# Altium schematic sheet FlightController.SchDoc
size A3; Date: 26.03.2022; Engineer: Burak; SheetNumber: 1; SheetTotal: 1; SheetSize: A3
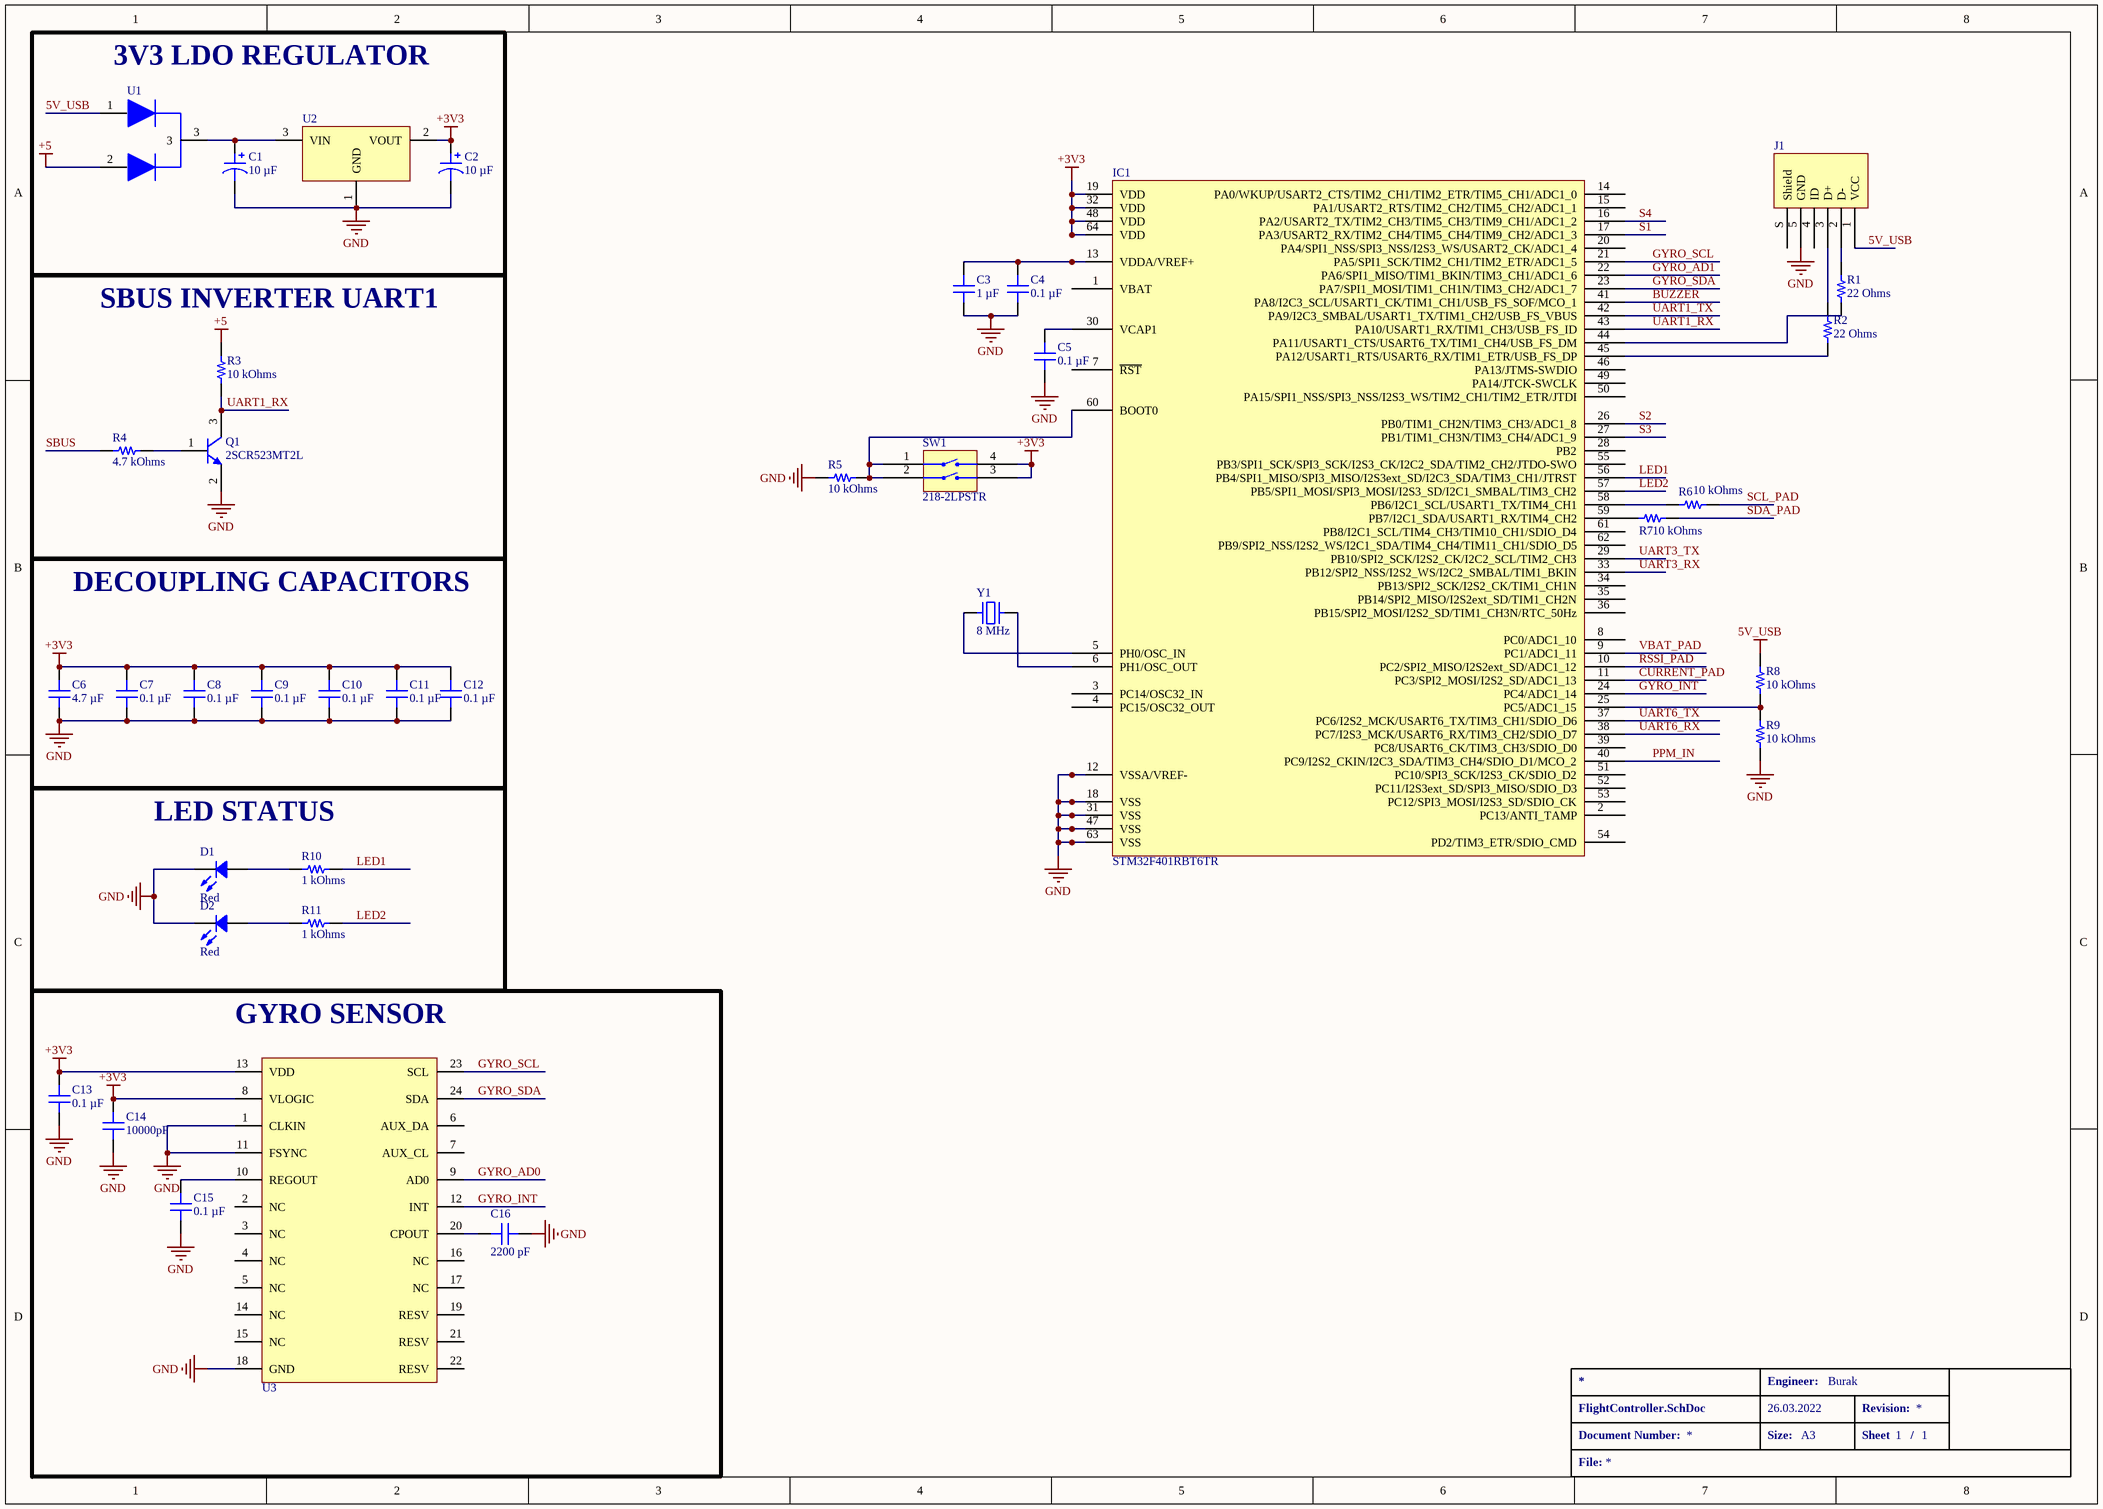
[diagram p0: FlightController.SchDoc]

## Parts
C1  10 µF  [CAP ALSMD POLY 5.3MM H5.8MM]
C2  10 µF  [CAP ALSMD POLY 5.3MM H5.8MM]
C3  1 µF  [CAP 0805_2012]
C4  0.1 µF  [CAP 0805_2012]
C5  0.1 µF  [CAP 0805_2012]
C6  4.7 µF  [CAP 0805_2012]
C7  0.1 µF  [CAP 0805_2012]
C8  0.1 µF  [CAP 0805_2012]
C9  0.1 µF  [CAP 0805_2012]
C10  0.1 µF  [CAP 0805_2012]
C11  0.1 µF  [CAP 0805_2012]
C12  0.1 µF  [CAP 0805_2012]
C13  0.1 µF  [CAP 0805_2012]
C14  10000pF  [CAP 0805_2012]
C15  0.1 µF  [CAP 0805_2012]
C16  2200 pF  [CAP 0805_2012]
D1  Red  [LED 1206_3216 RED]
D2  Red  [LED 1206_3216 RED]
IC1  STM32F401RBT6TR  [ST LQFP-64 10X10MM]
J1  10118193-0001LF  [FCI USB 10118193-0001LF]  (value not drawn)
Q1  2SCR523MT2L  [ROHM SOT-723]
R1  22 Ohms  [RES 0805_2012]
R2  22 Ohms  [RES 0805_2012]
R3  10 kOhms  [RES 0805_2012]
R4  4.7 kOhms  [RES 0805_2012]
R5  10 kOhms  [RES 0805_2012]
R6  10 kOhms  [RES 0805_2012]
R7  10 kOhms  [RES 0805_2012]
R8  10 kOhms  [RES 0805_2012]
R9  10 kOhms  [RES 0805_2012]
R10  1 kOhms  [RES 0805_2012]
R11  1 kOhms  [RES 0805_2012]
SW1  218-2LPSTR  [CTS 218-2LPJ]
U1  BAT54C  [SOT-23]  (value not drawn)
U2  IC REG LDO 3.3V 1A SOT223  [SOT223]  (value not drawn)
U3  GYRO SENSOR  [QFN_24PINS]  (value not drawn)
Y1  8 MHz  [ABRACON ABLS]

## Blocks framed on the sheet
3V3 LDO REGULATOR: C1 C2 U1 U2
SBUS INVERTER UART1: Q1 R3 R4
DECOUPLING CAPACITORS: C6-C12
LED STATUS: D1 D2 R10 R11
GYRO SENSOR: C13-C16 U3

## Nets
5V_USB: J1.1(VCC) R8.2 U1.1
+3V3: C2.1 C6.2 C7.2 C8.2 C9.2 C10.2 C11.2 C12.2 C13.2 C14.2 IC1.19(VDD) IC1.32(VDD) IC1.48(VDD) IC1.64(VDD) SW1.3(GND) SW1.4(GND) U2.2(VOUT) U3.8(VLOGIC) U3.13(VDD)
+5: R3.2 U1.2
GND: C1.2 C2.2 C3.1 C4.1 C5.1 C6.1 C7.1 C8.1 C9.1 C10.1 C11.1 C12.1 C13.1 C14.1 C15.1 C16.2 D1.2 D2.2 IC1.12(VSSA/VREF-) IC1.18(VSS) IC1.31(VSS) IC1.47(VSS) IC1.63(VSS) J1.5(GND) Q1.2(E) R5.2 R9.1 U2.1(GND) U3.1(CLKIN) U3.11(FSYNC) U3.18(GND)
BUZZER: IC1.41(PA8/I2C3_SCL/USART1_CK/TIM1_CH1/USB_FS_SOF/MCO_1)
CURRENT_PAD: IC1.11(PC3/SPI2_MOSI/I2S2_SD/ADC1_13)
GYRO_AD0: U3.9(AD0)
GYRO_AD1: IC1.22(PA6/SPI1_MISO/TIM1_BKIN/TIM3_CH1/ADC1_6)
GYRO_INT: IC1.24(PC4/ADC1_14) U3.12(INT)
GYRO_SCL: IC1.21(PA5/SPI1_SCK/TIM2_CH1/TIM2_ETR/ADC1_5) U3.23(SCL)
GYRO_SDA: IC1.23(PA7/SPI1_MOSI/TIM1_CH1N/TIM3_CH2/ADC1_7) U3.24(SDA)
LED1: IC1.56(PB4/SPI1_MISO/SPI3_MISO/I2S3ext_SD/I2C3_SDA/TIM3_CH1/JTRST) R10.2
LED2: IC1.57(PB5/SPI1_MOSI/SPI3_MOSI/I2S3_SD/I2C1_SMBAL/TIM3_CH2) R11.2
PPM_IN: IC1.40(PC9/I2S2_CKIN/I2C3_SDA/TIM3_CH4/SDIO_D1/MCO_2)
RSSI_PAD: IC1.10(PC2/SPI2_MISO/I2S2ext_SD/ADC1_12)
S1: IC1.17(PA3/USART2_RX/TIM2_CH4/TIM5_CH4/TIM9_CH2/ADC1_3)
S2: IC1.26(PB0/TIM1_CH2N/TIM3_CH3/ADC1_8)
S3: IC1.27(PB1/TIM1_CH3N/TIM3_CH4/ADC1_9)
S4: IC1.16(PA2/USART2_TX/TIM2_CH3/TIM5_CH3/TIM9_CH1/ADC1_2)
SBUS: R4.1
SCL_PAD: R6.1
SDA_PAD: R7.1
UART1_RX: IC1.43(PA10/USART1_RX/TIM1_CH3/USB_FS_ID) Q1.3(C) R3.1
UART1_TX: IC1.42(PA9/I2C3_SMBAL/USART1_TX/TIM1_CH2/USB_FS_VBUS)
UART3_RX: IC1.33(PB12/SPI2_NSS/I2S2_WS/I2C2_SMBAL/TIM1_BKIN)
UART3_TX: IC1.29(PB10/SPI2_SCK/I2S2_CK/I2C2_SCL/TIM2_CH3)
UART6_RX: IC1.38(PC7/I2S3_MCK/USART6_RX/TIM3_CH2/SDIO_D7)
UART6_TX: IC1.37(PC6/I2S2_MCK/USART6_TX/TIM3_CH1/SDIO_D6)
VBAT_PAD: IC1.9(PC1/ADC1_11)
NetC1_1: C1.1 U1.3 U2.3(VIN)
NetC3_2: C3.2 C4.2 IC1.13(VDDA/VREF+)
NetC5_2: C5.2 IC1.30(VCAP1)
NetC15_2: C15.2 U3.10(REGOUT)
NetC16_1: C16.1 U3.20(CPOUT)
NetD1_1: D1.1 R10.1
NetD2_1: D2.1 R11.1
NetIC1_5: IC1.5(PH0/OSC_IN) Y1.1
NetIC1_6: IC1.6(PH1/OSC_OUT) Y1.2
NetIC1_25: IC1.25(PC5/ADC1_15) R8.1 R9.2
NetIC1_44: IC1.44(PA11/USART1_CTS/USART6_TX/TIM1_CH4/USB_FS_DM) R1.1
NetIC1_45: IC1.45(PA12/USART1_RTS/USART6_RX/TIM1_ETR/USB_FS_DP) R2.1
NetIC1_58: IC1.58(PB6/I2C1_SCL/USART1_TX/TIM4_CH1) R6.2
NetIC1_59: IC1.59(PB7/I2C1_SDA/USART1_RX/TIM4_CH2) R7.2
NetIC1_60: IC1.60(BOOT0) R5.1 SW1.1(GND) SW1.2(GND)
NetJ1_2: J1.2(D-) R1.2
NetJ1_3: J1.3(D+) R2.2
NetQ1_1: Q1.1(B) R4.2

Not connected (* = marked no-connect by the designer): IC1 1(VBAT) 2(PC13/ANTI_TAMP) 3(PC14/OSC32_IN) 4(PC15/OSC32_OUT) 7(~{RST}) 8(PC0/ADC1_10) 14(PA0/WKUP/USART2_CTS/TIM2_CH1/TIM2_ETR/TIM5_CH1/ADC1_0) 15(PA1/USART2_RTS/TIM2_CH2/TIM5_CH2/ADC1_1) 20(PA4/SPI1_NSS/SPI3_NSS/I2S3_WS/USART2_CK/ADC1_4) 28(PB2) 34(PB13/SPI2_SCK/I2S2_CK/TIM1_CH1N) 35(PB14/SPI2_MISO/I2S2ext_SD/TIM1_CH2N) 36(PB15/SPI2_MOSI/I2S2_SD/TIM1_CH3N/RTC_50Hz) 39(PC8/USART6_CK/TIM3_CH3/SDIO_D0) 46(PA13/JTMS-SWDIO) 49(PA14/JTCK-SWCLK) 50(PA15/SPI1_NSS/SPI3_NSS/I2S3_WS/TIM2_CH1/TIM2_ETR/JTDI) 51(PC10/SPI3_SCK/I2S3_CK/SDIO_D2) 52(PC11/I2S3ext_SD/SPI3_MISO/SDIO_D3) 53(PC12/SPI3_MOSI/I2S3_SD/SDIO_CK) 54(PD2/TIM3_ETR/SDIO_CMD) 55(PB3/SPI1_SCK/SPI3_SCK/I2S3_CK/I2C2_SDA/TIM2_CH2/JTDO-SWO) 61(PB8/I2C1_SCL/TIM4_CH3/TIM10_CH1/SDIO_D4) 62(PB9/SPI2_NSS/I2S2_WS/I2C1_SDA/TIM4_CH4/TIM11_CH1/SDIO_D5); J1 4(ID) S(Shield); U3 2(NC) 3(NC) 4(NC) 5(NC) 6(AUX_DA) 7(AUX_CL) 14(NC) 15(NC) 16(NC) 17(NC) 19(RESV) 21(RESV) 22(RESV)

## Notes on the sheet
- Engineer:
- Document Number:
- Size:
- Sheet
- Revision:
- /
- File:

## Library data of the parts
C1 C2 = 875105359001: CAP ALUM POLY 10UF 20% 16V SMD; manufacturer: Würth Elektronik; ESR (Equivalent Series Resistance): 30mOhm; Lifetime @ Temp.: 2000 Hrs @ 105°C; Ripple Current @ High Frequency: 2.2 A @ 100 kHz; Ripple Current @ Low Frequency: 110 mA @ 120 Hz; Surface Mount Land Size: 0.209" L x 0.209" W (5.30mm x 5.30mm); Type: Polymer; Part Number: 875105359001; Applications: General Purpose; Capacitance: 10 µF; componentlink1description: Datasheet; componentlink1url: https://katalog.we-online.de/pbs/datasheet/875105359001.pdf; componentlink2description: DigiKey Link; componentlink2url: https://www.digikey.com/en/products/detail/würth-elektronik/875105359001/5147580; Device Package: Radial, Can - SMD; Height - Seated (Max): 0.228" (5.80mm); lastupdated: 25.06.2022 14:19:37; Lifecycle Status: Active; Minimum Order: 1; Mounting Type: Surface Mount; Operating Temperature: -55°C ~ 105°C; Package / Case: Radial, Can - SMD; packaging: TapeAndReel; partid: 1907; Part Status: Active; price: 0.28; series: WCAP-PSLP; Size / Dimension: 0.197" Dia (5.00mm); Supplier 1: DigiKey; Supplier Part Number 1: 732-6416-1-ND; Tolerance: ±20%; value: 10 µF; Voltage - Rated: 16 V
C3 = C2012X8R1C105K125AB: CAP CER 1UF 16V X8R 0805; manufacturer: TDK Corporation; Tolerance: ±10%; Part Number: C2012X8R1C105K125AB; Value: 1 µF; Applications: General Purpose; Capacitance: 1 µF; componentlink1description: Datasheet; componentlink1url: https://product.tdk.com/info/en/catalog/datasheets/mlcc_commercial_hightemp_en.pdf?ref_disty=digikey; componentlink2description: DigiKey Link; componentlink2url: https://www.digikey.com/en/products/detail/tdk-corporation/C2012X8R1C105K125AB/3248171; Device Package: 0805 (2012 Metric); Features: High Temperature; lastupdated: 25.03.2022 19:02:17; Lifecycle Status: Active; Minimum Order: 1; Mounting Type: Surface Mount, MLCC; Operating Temperature: -55°C ~ 150°C; Package / Case: 0805 (2012 Metric); packaging: TapeAndReel; partid: 2997; Part Status: Active; price: 0.08; series: C; Size / Dimension: 0.079" L x 0.049" W (2.00mm x 1.25mm); Supplier 1: DigiKey; Supplier Part Number 1: 445-8829-1-ND; Temperature Coefficient: X8R; Thickness (Max): 0.057" (1.45mm); Voltage - Rated: 16V
C4 C5 C7-C12 = 160R15W104KV4T: CAP CER 0.1UF 16V X7R 0805; manufacturer: Johanson Dielectrics Inc.; Tolerance: ±10%; Part Number: 160R15W104KV4T; Value: 0.1 µF; Applications: General Purpose; Capacitance: 0.1 µF; componentlink1description: Datasheet; componentlink1url: https://www.johansondielectrics.com/downloads/catalog/johanson-dielectrics-product-catalog.pdf; componentlink2description: DigiKey Link; componentlink2url: https://www.digikey.com/en/products/detail/johanson-dielectrics-inc/160R15W104KV4T/1859428; Device Package: 0805 (2012 Metric); lastupdated: 25.03.2022 19:02:00; Lifecycle Status: Active; Minimum Order: 1; Mounting Type: Surface Mount, MLCC; Operating Temperature: -55°C ~ 125°C; Package / Case: 0805 (2012 Metric); packaging: TapeAndReel; partid: 9125; Part Status: Active; price: 0.03; series: -; Size / Dimension: 0.080" L x 0.050" W (2.03mm x 1.27mm); Supplier 1: DigiKey; Supplier Part Number 1: 709-1183-1-ND; Temperature Coefficient: X7R; Thickness (Max): 0.050" (1.27mm); Voltage - Rated: 16V
C6 = CL21A475KPFNNNE: CAP CER 4.7UF 10V X5R 0805; manufacturer: Samsung Electro-Mechanics; Tolerance: ±10%; Part Number: CL21A475KPFNNNE; Value: 4.7 µF; Applications: General Purpose; Capacitance: 4.7 µF; componentlink1description: Datasheet; componentlink1url: http://www.samsungsem.com/kr/support/product-search/mlcc/CL21A475KPFNNNE.jsp; componentlink2description: DigiKey Link; componentlink2url: https://www.digikey.com/en/products/detail/samsung-electro-mechanics/CL21A475KPFNNNE/3886917; Device Package: 0805 (2012 Metric); lastupdated: 25.03.2022 19:02:16; Lifecycle Status: Active; Minimum Order: 1; Mounting Type: Surface Mount, MLCC; Operating Temperature: -55°C ~ 85°C; Package / Case: 0805 (2012 Metric); packaging: TapeAndReel; partid: 3193; Part Status: Active; price: 0.01; series: CL; Size / Dimension: 0.079" L x 0.049" W (2.00mm x 1.25mm); Supplier 1: DigiKey; Supplier Part Number 1: 1276-1259-1-ND; Temperature Coefficient: X5R; Thickness (Max): 0.053" (1.35mm); Voltage - Rated: 10V
C13 C15 = 0805B104K160CT: CAP CER 0.1UF 16V X7R 0805; manufacturer: Walsin Technology Corporation; Tolerance: ±10%; Part Number: 0805B104K160CT; Value: 0.1 µF; Applications: General Purpose; Capacitance: 0.1 µF; componentlink1description: Datasheet; componentlink1url: http://www.passivecomponent.com/wp-content/uploads/2018/10/MLCC.pdf; componentlink2description: DigiKey Link; componentlink2url: https://www.digikey.com/en/products/detail/walsin-technology-corporation/0805B104K160CT/9355062; Device Package: 0805 (2012 Metric); lastupdated: 2.04.2022 05:58:35; Lifecycle Status: Active; Minimum Order: 1; Mounting Type: Surface Mount, MLCC; Operating Temperature: -55°C ~ 125°C; Package / Case: 0805 (2012 Metric); packaging: TapeAndReel; partid: 4882; Part Status: Active; price: 0.01; series: -; Size / Dimension: 0.079" L x 0.049" W (2.00mm x 1.25mm); Supplier 1: DigiKey; Supplier Part Number 1: 1292-1565-1-ND; Temperature Coefficient: X7R; Thickness (Max): 0.035" (0.90mm); Voltage - Rated: 16V
C14 = 0805YC103KAT2A: CAP CER 10000PF 16V X7R 0805; manufacturer: AVX Corporation; Tolerance: ±10%; Part Number: 0805YC103KAT2A; Value: 10000pF; Applications: General Purpose; Capacitance: 10000pF; componentlink1description: Datasheet; componentlink1url: http://datasheets.avx.com/X7RDielectric.pdf; componentlink2description: DigiKey Link; componentlink2url: http://digikey.com/product-detail/en/avx-corporation/0805YC103KAT2A/478-12793-1-ND/9949333; Device Package: 0805 (2012 Metric); lastupdated: 2.09.2020 01:04:37; Lifecycle Status: Active; Minimum Order: 1; Mounting Type: Surface Mount, MLCC; Operating Temperature: -55°C ~ 125°C; Package / Case: 0805 (2012 Metric); packaging: TapeAndReel; partid: 5374; Part Status: Active; price: 0.03; series: -; Size / Dimension: 0.079" L x 0.049" W (2.01mm x 1.25mm); Supplier 1: DigiKey; Supplier Part Number 1: 478-12793-1-ND; Temperature Coefficient: X7R; Thickness (Max): 0.037" (0.94mm); Voltage - Rated: 16V
C16 = 885012207009: CAP CER 2200PF 10V X7R 0805; manufacturer: Würth Elektronik; Tolerance: ±10%; Part Number: 885012207009; Value: 2200 pF; Applications: General Purpose; Capacitance: 2200 pF; componentlink1description: Datasheet; componentlink1url: https://katalog.we-online.de/pbs/datasheet/885012207009.pdf; componentlink2description: DigiKey Link; componentlink2url: https://www.digikey.com/en/products/detail/würth-elektronik/885012207009/5453874; Device Package: 0805 (2012 Metric); lastupdated: 2.04.2022 05:58:23; Lifecycle Status: Active; Minimum Order: 1; Mounting Type: Surface Mount, MLCC; Operating Temperature: -55°C ~ 125°C; Package / Case: 0805 (2012 Metric); packaging: TapeAndReel; partid: 9414; Part Status: Active; price: 0.03; series: WCAP-CSGP; Size / Dimension: 0.079" L x 0.049" W (2.00mm x 1.25mm); Supplier 1: DigiKey; Supplier Part Number 1: 732-8019-1-ND; Temperature Coefficient: X7R; Thickness (Max): 0.035" (0.90mm); Voltage - Rated: 10V
D1 D2 = 5973111402F: LED RED CLEAR 1206 SMD; Manufacturer: Dialight; Configuration: Standard; Current - Test: 20mA; Lens Color: Colorless; Lens Style: Round with Flat Top; Millicandela Rating: 33.6mcd; Viewing Angle: 70°; Voltage - Forward (Vf) (Typ): 1.7V; Wavelength - Dominant: 647nm; Wavelength - Peak: 660nm; Part Number: 5973111402F; Color: Red; ComponentLink1Description: Datasheet; ComponentLink1URL: http://www.dialightsignalsandcomponents.com/Assets/Brochures_And_Catalogs/Indication/SMT_selector_guide.pdf; ComponentLink2Description: DigiKey Link; ComponentLink2URL: https://www.digikey.com/en/products/detail/dialight/5973111402F/2432500; Device Package: 1206 (3216 Metric); Height (Max): 1.51mm; LastUpdated: 25.03.2022 19:41:37; Lens Transparency: Clear; Lifecycle Status: Active; Minimum Order: 1; Mounting Type: Surface Mount; Package / Case: 1206 (3216 Metric); Packaging: Strip; PartId: 1070; Part Status: Active; Price: 0.27; Series: 597; Size / Dimension: 3.00mm L x 1.50mm W; Supplier 1: DigiKey; Supplier Part Number 1: 350-2880-ND; Supplier Device Package: 1206; Value: Red
IC1 = STM32F401RBT6TR: IC MCU 32BIT 128KB FLASH 64LQFP; Manufacturer: STMicroelectronics; Connectivity: I²C, IrDA, LINbus, SDIO, SPI, UART/USART, USB OTG; Core Processor: ARM® Cortex®-M4; Core Size: 32-Bit; Data Converters: A/D 16x12b; Number of I/O: 50; Oscillator Type: Internal; Peripherals: Brown-out Detect/Reset, DMA, I²S, POR, PWM, WDT; Program Memory Size: 128KB (128K x 8); RAM Size: 64K x 8; Speed: 84MHz; Voltage - Supply (Vcc/Vdd): 1.7V ~ 3.6V; Part Number: STM32F401RBT6TR; ComponentLink1Description: Datasheet; ComponentLink1URL: http://www.st.com/content/ccc/resource/technical/document/datasheet/9e/50/b1/5a/5f/ae/4d/c1/DM00086815.pdf/files/DM00086815.pdf/jcr:content/translations/en.DM00086815.pdf; ComponentLink2Description: DigiKey Link; ComponentLink2URL: //digikey.com/product-detail/en/stmicroelectronics/STM32F401RBT6TR/497-18782-2-ND/5268280; Device Package: 64-LQFP; LastUpdated: 4.12.2019 05:53:46; Lifecycle Status: 0; Minimum Order: 1; Mounting Type: Surface Mount; Operating Temperature: -40°C ~ 85°C (TA); Package / Case: 64-LQFP; Packaging: TapeAndReel; PartId: 114; Part Status: Active; Price: 2.54; Program Memory Type: FLASH; Series: STM32F4; Supplier 1: DigiKey; Supplier Part Number 1: 497-18782-2-ND; Supplier Device Package: 64-LQFP (10x10)
J1 = 10118193-0001LF: CONN RCPT USB2.0 MICRO B SMD R/A; Manufacturer: Amphenol ICC (FCI); Connector Type: USB - micro B; Current Rating (Amps): 1.8A per Contact; Gender: Receptacle; Mating Cycles: 10000; Number of Contacts: 5; Number of Ports: 1; Shielding: Shielded; Voltage - Rated: 100VAC; Part Number: 10118193-0001LF; ComponentLink1Description: Datasheet; ComponentLink1URL: https://cdn.amphenol-icc.com/media/wysiwyg/files/documentation/datasheet/inputoutput/io_usb_micro.pdf; ComponentLink2Description: DigiKey Link; ComponentLink2URL: //digikey.com/product-detail/en/amphenol-icc-fci/10118193-0001LF/609-4616-2-ND/2785388; Features: Solder Retention; LastUpdated: 9.12.2019 20:51:28; Lifecycle Status: 0; Minimum Order: 1; Mounting Feature: Horizontal; Mounting Type: Surface Mount, Right Angle; Through Hole; Operating Temperature: -30°C ~ 80°C; Packaging: TapeAndReel; Part Status: Active; Price: 0.21; Series: -; Specifications: USB 2.0; Supplier 1: DigiKey; Supplier Part Number 1: 609-4616-2-ND; Termination: Solder
Q1 = 2SCR523MT2L: TRANS NPN 50V 0.1A VMT3; Manufacturer: Rohm Semiconductor; Current - Collector Cutoff (Max): 100nA (ICBO); Current - Collector (Ic) (Max): 100 mA; DC Current Gain (hFE) (Min) @ Ic, Vce: 120 @ 1mA, 6V; Frequency - Transition: 350MHz; Power - Max: 150 mW; Vce Saturation (Max) @ Ib, Ic: 300mV @ 5mA, 50mA; Part Number: 2SCR523MT2L; ComponentLink1Description: Datasheet; ComponentLink1URL: http://rohmfs.rohm.com/en/products/databook/datasheet/discrete/transistor/bipolar/2scr523mt2l-e.pdf; ComponentLink2Description: DigiKey Link; ComponentLink2URL: https://www.digikey.com/en/products/detail/rohm-semiconductor/2SCR523MT2L/5019055; LastUpdated: 29.06.2022 14:53:08; Lifecycle Status: Active; Minimum Order: 1; Mounting Type: Surface Mount; Operating Temperature: 150°C (TJ); Package / Case: SOT-723; Packaging: TapeAndReel; PartId: 1; Part Status: Active; Price: 0.03; Series: -; Supplier 1: DigiKey; Supplier Part Number 1: 2SCR523MT2LCT-ND; Supplier Device Package: VMT3; Transistor Type: NPN; Voltage - Collector Emitter Breakdown (Max): 50 V
R1 R2 = CPF0805B22RE1: RES SMD 22 OHM 0.1% 1/10W 0805; Manufacturer: TE Connectivity Passive Product; Power (Watts): 0.1W, 1/10W; Temperature Coefficient: ±25ppm/°C; Part Number: CPF0805B22RE1; Value: 22 Ohms; ComponentLink1Description: Datasheet; ComponentLink1URL: https://www.te.com/commerce/DocumentDelivery/DDEController?Action=srchrtrv&DocNm=1773200&DocType=DS&DocLang=English; ComponentLink2Description: DigiKey Link; ComponentLink2URL: https://www.digikey.com/en/products/detail/te-connectivity-passive-product/CPF0805B22RE1/2381993; Composition: Thin Film; Device Package: 0805 (2012 Metric); Height - Seated (Max): 0.026" (0.65mm); LastUpdated: 2.04.2022 06:26:45; Lifecycle Status: Active; Minimum Order: 1; Number of Terminations: 2; Operating Temperature: -55°C ~ 155°C; Package / Case: 0805 (2012 Metric); Packaging: TapeAndReel; PartId: 28451; Part Status: Active; Price: 0.13; Resistance: 22 Ohms; Series: CPF, Neohm; Size / Dimension: 0.079" L x 0.049" W (2.00mm x 1.25mm); Supplier 1: DigiKey; Supplier Part Number 1: A103179CT-ND; Supplier Device Package: 0805; Tolerance: ±0.1%
R3 R5-R9 = RNCS0805BKE10K0: RES 10K OHM 0.1% 1/10W 0805; Manufacturer: Stackpole Electronics Inc; Power (Watts): 0.1W, 1/10W; Temperature Coefficient: ±25ppm/°C; Part Number: RNCS0805BKE10K0; Value: 10 kOhms; ComponentLink1Description: Datasheet; ComponentLink1URL: https://www.seielect.com/catalog/sei-rncs_rnch.pdf; ComponentLink2Description: DigiKey Link; ComponentLink2URL: https://www.digikey.com/en/products/detail/stackpole-electronics-inc/RNCS0805BKE10K0/1800067; Composition: Thin Film; Device Package: 0805 (2012 Metric); Features: Anti-Corrosive, Automotive AEC-Q200, Moisture Resistant; Height - Seated (Max): 0.026" (0.65mm); LastUpdated: 25.03.2022 19:30:13; Lifecycle Status: Active; Minimum Order: 1; Number of Terminations: 2; Operating Temperature: -55°C ~ 155°C; Package / Case: 0805 (2012 Metric); Packaging: TapeAndReel; PartId: 27713; Part Status: Active; Price: 0.09; Ratings: AEC-Q200; Resistance: 10 kOhms; Series: RNCS; Size / Dimension: 0.079" L x 0.049" W (2.00mm x 1.25mm); Supplier 1: DigiKey; Supplier Part Number 1: RNCS0805BKE10K0CT-ND; Supplier Device Package: 0805; Tolerance: ±0.1%
R4 = RCS08054K70JNEA: RES SMD 4.7K OHM 5% 0.4W 0805; Manufacturer: Vishay Dale; Power (Watts): 0.4W, 2/5W; Temperature Coefficient: ±200ppm/°C; Part Number: RCS08054K70JNEA; Value: 4.7 kOhms; ComponentLink1Description: Datasheet; ComponentLink1URL: http://www.vishay.com/docs/20065/rcse3.pdf; ComponentLink2Description: DigiKey Link; ComponentLink2URL: https://www.digikey.com/en/products/detail/vishay-dale/RCS08054K70JNEA/5867012; Composition: Thick Film; Device Package: 0805 (2012 Metric); Features: Automotive AEC-Q200, Pulse Withstanding; Height - Seated (Max): 0.020" (0.50mm); LastUpdated: 25.03.2022 19:30:13; Lifecycle Status: Active; Minimum Order: 1; Number of Terminations: 2; Operating Temperature: -55°C ~ 155°C; Package / Case: 0805 (2012 Metric); Packaging: TapeAndReel; PartId: 27839; Part Status: Active; Price: 0.02; Ratings: AEC-Q200; Resistance: 4.7 kOhms; Series: RCS e3; Size / Dimension: 0.079" L x 0.049" W (2.00mm x 1.25mm); Supplier 1: DigiKey; Supplier Part Number 1: 541-2866-1-ND; Supplier Device Package: 0805; Tolerance: ±5%
R10 R11 = RNCS0805BKE1K00: RES 1K OHM 0.1% 1/10W 0805; Manufacturer: Stackpole Electronics Inc; Power (Watts): 0.1W, 1/10W; Temperature Coefficient: ±25ppm/°C; Part Number: RNCS0805BKE1K00; Value: 1 kOhms; ComponentLink1Description: Datasheet; ComponentLink1URL: https://www.seielect.com/catalog/sei-rncs_rnch.pdf; ComponentLink2Description: DigiKey Link; ComponentLink2URL: https://www.digikey.com/en/products/detail/stackpole-electronics-inc/RNCS0805BKE1K00/1800073; Composition: Thin Film; Device Package: 0805 (2012 Metric); Features: Anti-Corrosive, Automotive AEC-Q200, Moisture Resistant; Height - Seated (Max): 0.026" (0.65mm); LastUpdated: 25.03.2022 19:30:13; Lifecycle Status: Active; Minimum Order: 1; Number of Terminations: 2; Operating Temperature: -55°C ~ 155°C; Package / Case: 0805 (2012 Metric); Packaging: TapeAndReel; PartId: 27715; Part Status: Active; Price: 0.09; Ratings: AEC-Q200; Resistance: 1 kOhms; Series: RNCS; Size / Dimension: 0.079" L x 0.049" W (2.00mm x 1.25mm); Supplier 1: DigiKey; Supplier Part Number 1: RNCS0805BKE1K00CT-ND; Supplier Device Package: 0805; Tolerance: ±0.1%
SW1 = 218-2LPSTR: SWITCH SLIDE DIP SPST 25MA 24V; Manufacturer: CTS Electrocomponents; Actuator Level: Flush, Recessed; Actuator Type: Slide (Standard); Number of Positions: 2; Pitch: 0.050" (1.27mm), Half; Voltage Rating: 24VDC; Washable: Yes; Part Number: 218-2LPSTR; Circuit: SPST; ComponentLink1Description: Datasheet; ComponentLink1URL: https://www.ctscorp.com/wp-content/uploads/218.pdf; ComponentLink2Description: DigiKey Link; ComponentLink2URL: http://digikey.com/product-detail/en/cts-electrocomponents/218-2LPSTR/CT3108CT-ND/5875762; Contact Finish: Gold; Contact Material: Beryllium Copper; Current Rating (Amps): 25mA; Features: Epoxy Sealed Terminals, Tape Seal; Height Above Board: 0.104" (2.65mm); LastUpdated: 4.01.2020 18:51:31; Lifecycle Status: Active; Minimum Order: 1; Mounting Type: Surface Mount; Operating Temperature: -55°C ~ 85°C; Packaging: ReReel; PartId: 8; Part Status: Active; Price: 0.00; Series: 218; Supplier 1: DigiKey; Supplier Part Number 1: CT3108CT-ND; Termination Style: Gull Wing
U1 = BAT54C: Rectifier Diode Small Signal Schottky 30V 0.2A 5ns Automotive 3-Pin SOT-23 T/R; Manufacturer: NXP Semiconductors; Forward Voltage: 800mV; Forward Current: 200mA; Element Configuration: Common Cathode; Max Forward Surge Current (Ifsm): 600mA; Current Rating: 200A; Capacitance: 10pF; Designed by: Burak; Supplier 1: Digi-Key; Manufacturer Part Number: BAT54C; RoHS: Yes; Category: Schottky Diodes; Case/Package: SOT-23-3; Number of Pins: 3; Min Operating Temperature: -55°C; Max Operating Temperature: 150°C; Packaging: Tape and Reel; Max Repetitive Reverse Voltage (Vrrm): 30V; Reverse Recovery Time: 5ns; Voltage Rating (DC): 30V; Termination: SMD/SMT; Voltage: 30V; RoHS Compliant: Yes; Lead Free: Lead Free; REACH SVHC: No SVHC; ComponentLink1URL: http://www.farnell.com/datasheets/2304092.pdf?src-supplier=Farnell; ComponentLink1Description: http://www.farnell.com/datasheets/2304092.pdf?src-supplier=Farnell; ComponentLink2URL: https://www.distrelec.biz/Web/Downloads/_t/ds/bat54-series_eng_tds.pdf?mime=application%2Fpdf&src-supplier=Distrelec; ComponentLink2Description: https://www.distrelec.biz/Web/Downloads/_t/ds/bat54-series_eng_tds.pdf?mime=application%2Fpdf&src-supplier=Distrelec; ComponentLink3URL: https://media.digikey.com/pdf/Data%20Sheets/ON%20Semiconductor%20PDFs/BAT54(A,C,S).pdf?src-supplier=Digi-Key; ComponentLink3Description: https://media.digikey.com/pdf/Data%20Sheets/ON%20Semiconductor%20PDFs/BAT54(A,C,S).pdf?src-supplier=Digi-Key; Supplier Part Number 1: BAT54CFSCT-ND
U2 = NCP1117ST33T3G: Manufacturer: ON Semiconductor; Max Input Voltage: 20V; Number of Outputs: 1; Dropout Voltage: 1.07V; Max Supply Voltage: 15V; Min Supply Voltage: 4.75V; Min Input Voltage: 3.5V; Input Bias Current: 6mA; Quiescent Current: 10mA; Polarity: Positive; Reference Voltage: 1.25V; Accuracy: 1%; Output Type: Fixed; Designed by: Burak; Supplier 1: Digi-Key; Manufacturer Part Number: NCP1117ST33T3G; RoHS: Yes; Category: Voltage Regulators - Linear; Stock 1: 11566; Pricing 1: 1=0,67000, 10=0,57500, 25=0,53680, 100=0,42950, 250=0,39880, 500=0,33744, 1000=0,26075 (USD); Mount: Surface Mount; Case/Package: SOT-223; Number of Pins: 3; Contact Plating: Tin,Matte; Min Operating Temperature: 0°C; Max Operating Temperature: 125°C; Output Voltage: 3.3V; Packaging: Tape and Reel; Output Current: 1A; Max Output Current: 1A; Package Quantity: 1; Nominal Output Voltage: 3.3V; Number of Regulators: 1; Min Current Limit: 1A; Min Output Voltage: 3.3V; Max Output Voltage: 3.3V; Termination: SMD/SMT; Output Voltage Accuracy: 1%; Length: 6.7mm; Width: 3.7mm; Height: 1.69mm; Radiation Hardening: No; REACH SVHC: No SVHC; Lead Free: Lead Free; Halogen Free: Halogen Free; RoHS Compliant: Yes; ComponentLink1URL: https://datasheet.ciiva.com/22697/1726422-22697602.pdf?src-supplier=Element14; ComponentLink1Description: https://datasheet.ciiva.com/22697/1726422-22697602.pdf?src-supplier=Element14; ComponentLink2URL: https://datasheet.ciiva.com/3224/ncp1117-d-3224144.pdf?src-supplier=Avnet; ComponentLink2Description: https://datasheet.ciiva.com/3224/ncp1117-d-3224144.pdf?src-supplier=Avnet; ComponentLink3URL: https://datasheet.ciiva.com/15111/getdatasheetpartid-82718-15111483.pdf?src-supplier=Verical; ComponentLink3Description: https://datasheet.ciiva.com/15111/getdatasheetpartid-82718-15111483.pdf?src-supplier=Verical; ComponentLink4URL: https://datasheet.ciiva.com/8073/1726422-8073735.pdf?src-supplier=Element14; ComponentLink4Description: https://datasheet.ciiva.com/8073/1726422-8073735.pdf?src-supplier=Element14; ComponentLink5URL: https://datasheet.ciiva.com/28483/1748260-28483307.pdf?src-supplier=Element14; ComponentLink5Description: https://datasheet.ciiva.com/28483/1748260-28483307.pdf?src-supplier=Element14; ComponentLink6URL: https://datasheet.ciiva.com/16382/ncp1117-d-16382636.pdf?src-supplier=Future+Electronics; ComponentLink6Description: https://datasheet.ciiva.com/16382/ncp1117-d-16382636.pdf?src-supplier=Future+Electronics; ComponentLink7URL: https://datasheet.ciiva.com/8233/ncp1117-d-8233589.pdf?src-supplier=Avnet; ComponentLink7Description: https://datasheet.ciiva.com/8233/ncp1117-d-8233589.pdf?src-supplier=Avnet; ComponentLink8URL: https://datasheet.ciiva.com/2042/ncp1117-d-2042028.pdf?src-supplier=Digi-Key; ComponentLink8Description: https://datasheet.ciiva.com/2042/ncp1117-d-2042028.pdf?src-supplier=Digi-Key; ComponentLink9URL: https://datasheet.ciiva.com/2042/ncp1117-d-2042029.pdf?src-supplier=Digi-Key; ComponentLink9Description: https://datasheet.ciiva.com/2042/ncp1117-d-2042029.pdf?src-supplier=Digi-Key; ComponentLink10URL: https://datasheet.ciiva.com/2042/ncp1117-d-2042027.pdf?src-supplier=Digi-Key; ComponentLink10Description: https://datasheet.ciiva.com/2042/ncp1117-d-2042027.pdf?src-supplier=Digi-Key; Supplier Part Number 1: NCP1117ST33T3GOSCT-ND
U3 = MPU-6050: IMU ACCEL/GYRO 3-AXIS I2C 24QFN; Manufacturer: TDK InvenSense; Sensor Type: Accelerometer,Gyroscope,3 Axis; Designed by: Burak; Supplier 1: Digi-Key; Manufacturer Part Number: MPU-6050; RoHS: Yes; Category: Inertial Measurement Units (IMUs); Pricing 1: 1=9,11000, 5=7,99200, 10=7,19300, 25=6,39400, 50=5,91440, 100=5,11520, 500=4,79550, 1000=4,47580 (USD); Mount: Surface Mount; Case/Package: QFN; Min Operating Temperature: -40°C; Max Operating Temperature: 85°C; Packaging: Tape and Reel; Output Type: I2C; Series: -; RoHS Compliant: Yes; ComponentLink1URL: https://datasheet.ciiva.com/1513/1788002-1513632.pdf?src-supplier=Element14; ComponentLink1Description: https://datasheet.ciiva.com/1513/1788002-1513632.pdf?src-supplier=Element14; ComponentLink2URL: https://datasheet.ciiva.com/22731/1788002-22731434.pdf?src-supplier=Element14; ComponentLink2Description: https://datasheet.ciiva.com/22731/1788002-22731434.pdf?src-supplier=Element14; Supplier Part Number 1: 1428-1007-1-ND
Y1 = ABLS-8.000MHZ-SD7Y-T: CRYSTAL 8.0000MHZ 18PF SMD; Manufacturer: Abracon LLC; ESR (Equivalent Series Resistance): 80 Ohms; Frequency Stability: ±30ppm; Frequency Tolerance: ±15ppm; Operating Mode: Fundamental; Part Number: ABLS-8.000MHZ-SD7Y-T; ComponentLink1Description: Datasheet; ComponentLink1URL: https://abracon.com/Resonators/abls.pdf; ComponentLink2Description: DigiKey Link; ComponentLink2URL: https://www.digikey.com/en/products/detail/abracon-llc/ABLS-8-000MHZ-SD7Y-T/8581989; Frequency: 8 MHz; Height - Seated (Max): 0.165" (4.20mm); LastUpdated: 2.04.2022 06:38:02; Lifecycle Status: Active; Load Capacitance: 18pF; Minimum Order: 1; Mounting Type: Surface Mount; Operating Temperature: -40°C ~ 85°C; Package / Case: HC-49/US; Packaging: CutTape; PartId: 25; Part Status: Active; Price: 0.27; Series: ABLS; Size / Dimension: 0.449" L x 0.185" W (11.40mm x 4.70mm); Supplier 1: DigiKey; Supplier Part Number 1: 535-14365-2-ND; Type: MHz Crystal; Value: 8 MHz